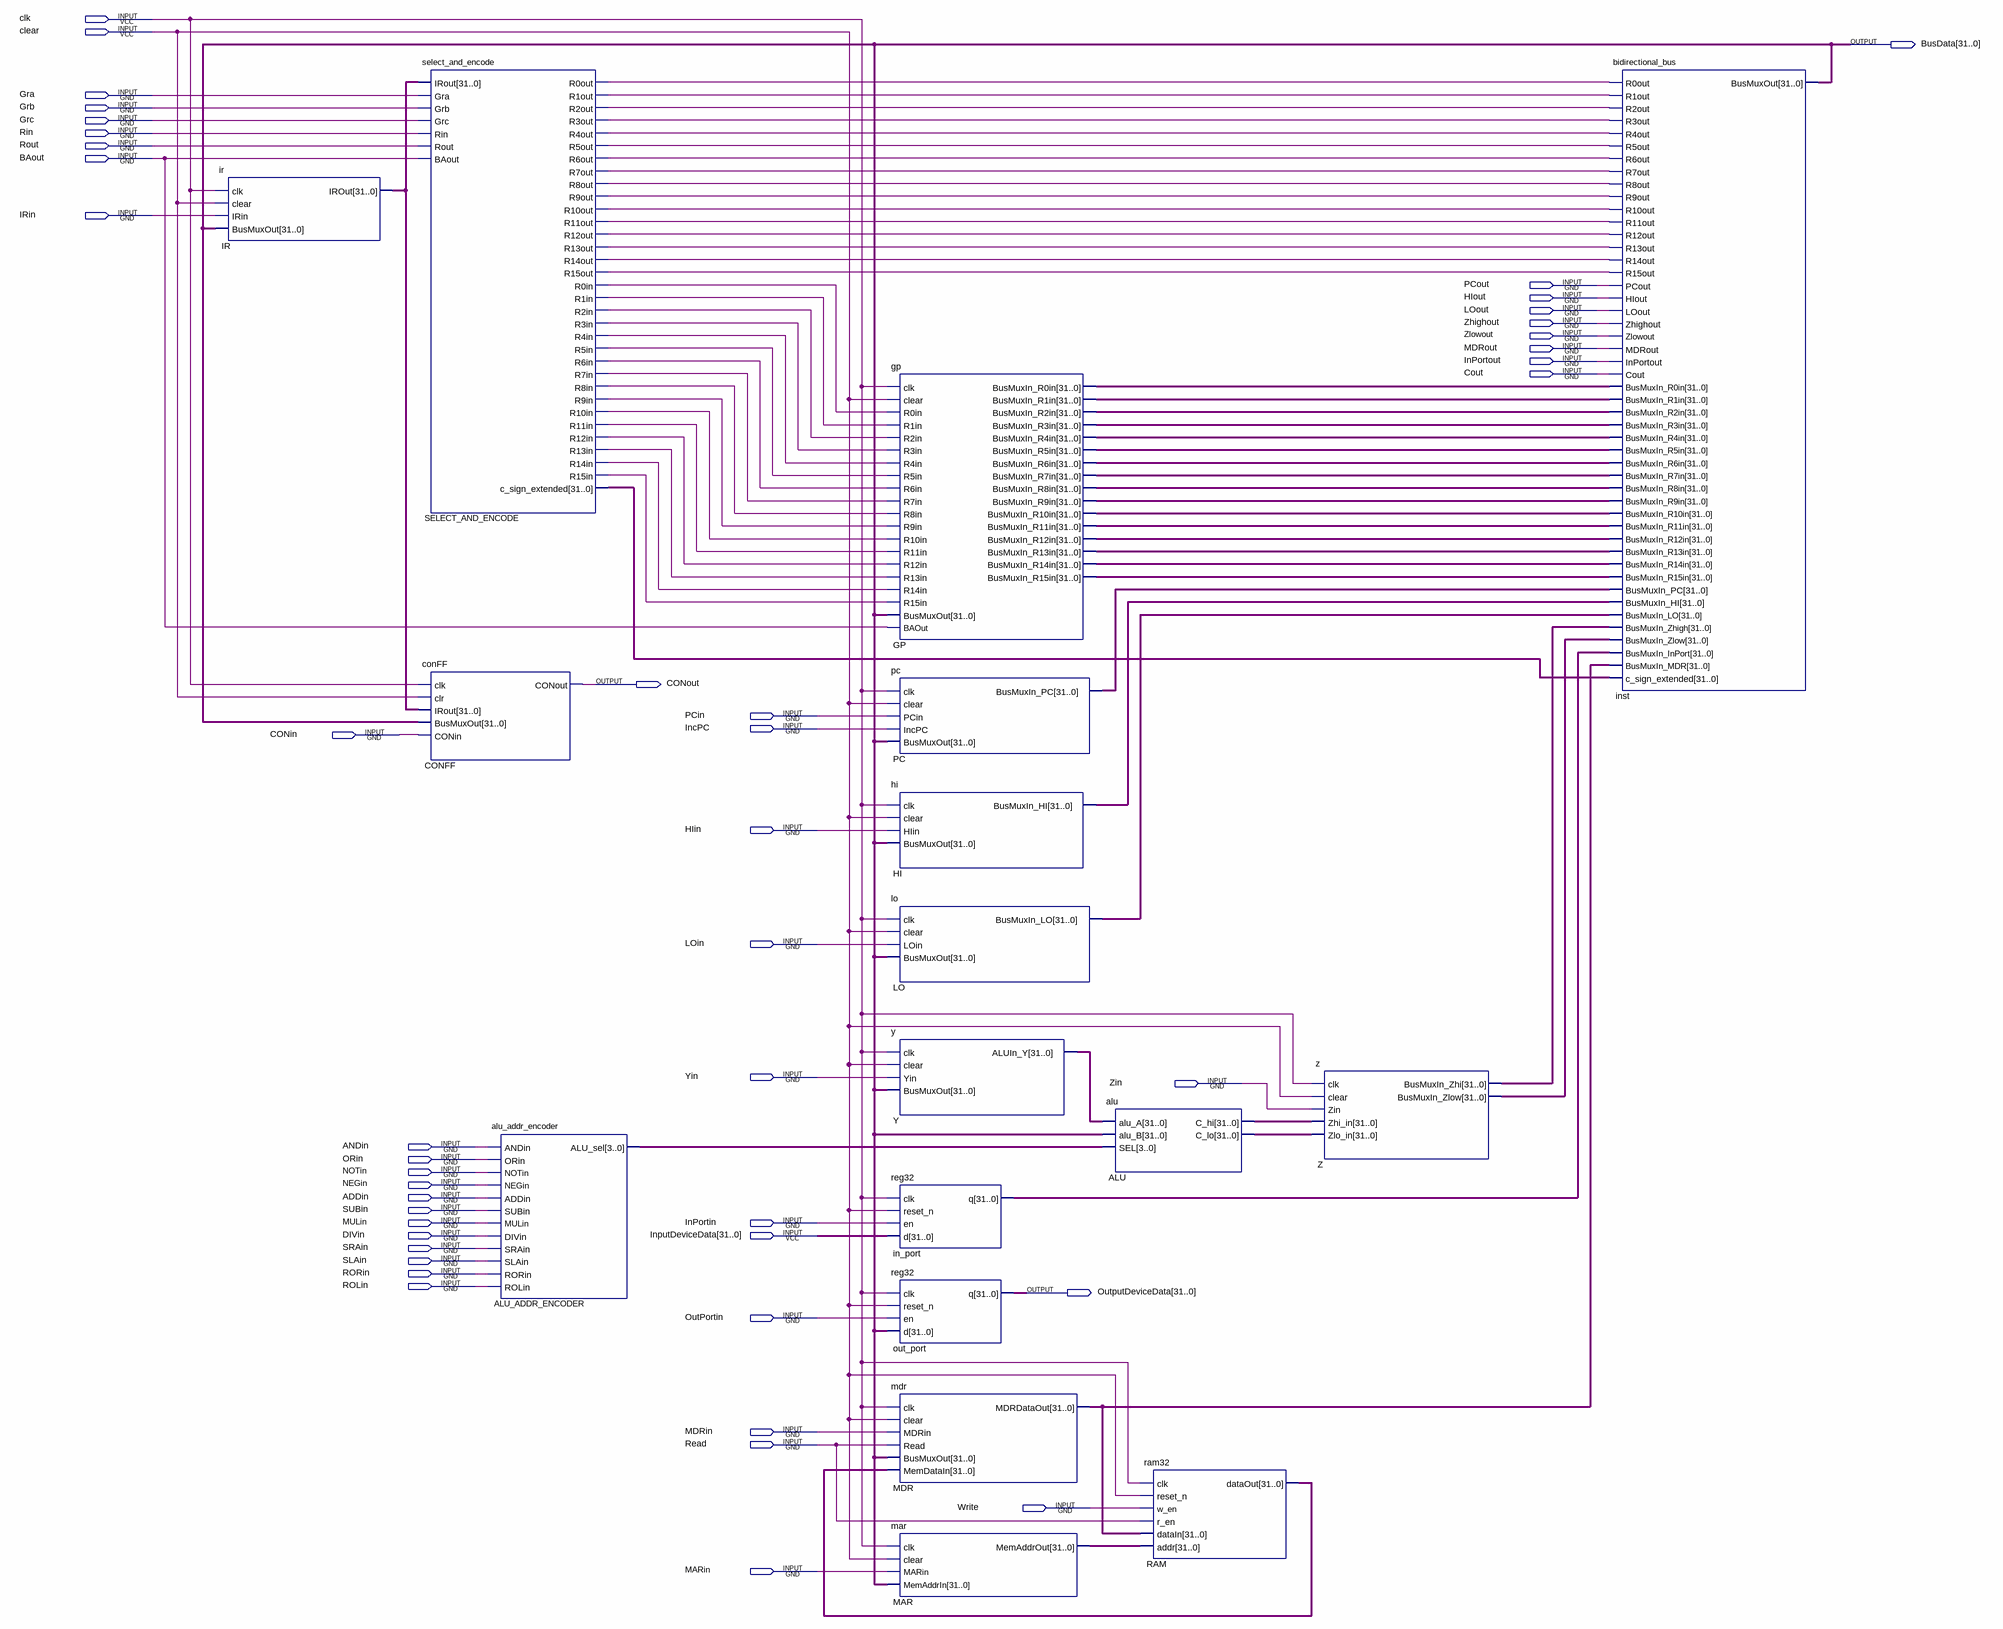
[diagram p0: schematic sheet]
// Quartus schematic datapath_design.bdf as structural Verilog: 17 symbols, 46 pins
module datapath_design (
  input  clk,
  input  clear,
  input  Gra,
  input  Grb,
  input  Grc,
  input  Rin,
  input  Rout,
  input  BAout,
  input  IRin,
  input  PCout,
  input  HIout,
  input  LOout,
  input  Zhighout,
  input  Zlowout,
  input  MDRout,
  input  InPortout,
  input  Cout,
  input  PCin,
  input  IncPC,
  input  CONin,
  input  HIin,
  input  LOin,
  input  Yin,
  input  Zin,
  input  ANDin,
  input  ORin,
  input  NOTin,
  input  NEGin,
  input  ADDin,
  input  SUBin,
  input  MULin,
  input  InPortin,
  input  DIVin,
  input  [31:0] InputDeviceData,
  input  SRAin,
  input  SLAin,
  input  RORin,
  input  ROLin,
  input  OutPortin,
  input  MDRin,
  input  Read,
  input  Write,
  input  MARin,
  output [31:0] BusData,
  output CONout,
  output [31:0] OutputDeviceData
);

  wire SELECT_AND_ENCODE_r0in, SELECT_AND_ENCODE_r0out, SELECT_AND_ENCODE_r1in, SELECT_AND_ENCODE_r1out,
       SELECT_AND_ENCODE_r2in, SELECT_AND_ENCODE_r2out, SELECT_AND_ENCODE_r3in, SELECT_AND_ENCODE_r3out,
       SELECT_AND_ENCODE_r4in, SELECT_AND_ENCODE_r4out, SELECT_AND_ENCODE_r5in, SELECT_AND_ENCODE_r5out,
       SELECT_AND_ENCODE_r6in, SELECT_AND_ENCODE_r6out, SELECT_AND_ENCODE_r7in, SELECT_AND_ENCODE_r7out,
       SELECT_AND_ENCODE_r8in, SELECT_AND_ENCODE_r8out, SELECT_AND_ENCODE_r9in, SELECT_AND_ENCODE_r9out,
       SELECT_AND_ENCODE_r10in, SELECT_AND_ENCODE_r10out, SELECT_AND_ENCODE_r11in, SELECT_AND_ENCODE_r11out,
       SELECT_AND_ENCODE_r12in, SELECT_AND_ENCODE_r12out, SELECT_AND_ENCODE_r13in, SELECT_AND_ENCODE_r13out,
       SELECT_AND_ENCODE_r14in, SELECT_AND_ENCODE_r14out, SELECT_AND_ENCODE_r15in, SELECT_AND_ENCODE_r15out;
  wire [3:0] ALU_ADDR_ENCODER_alu_sel;
  wire [31:0] ALU_c_hi, ALU_c_lo, GP_busmuxin_r0in, GP_busmuxin_r1in, GP_busmuxin_r2in, GP_busmuxin_r3in,
       GP_busmuxin_r4in, GP_busmuxin_r5in, GP_busmuxin_r6in, GP_busmuxin_r7in, GP_busmuxin_r8in,
       GP_busmuxin_r9in, GP_busmuxin_r10in, GP_busmuxin_r11in, GP_busmuxin_r12in, GP_busmuxin_r13in,
       GP_busmuxin_r14in, GP_busmuxin_r15in, HI_busmuxin_hi, in_port_q, IR_irout, LO_busmuxin_lo,
       MAR_memaddrout, MDR_mdrdataout, PC_busmuxin_pc, RAM_dataout, SELECT_AND_ENCODE_c_sign_extended,
       Y_aluin_y, Z_busmuxin_zhi, Z_busmuxin_zlow;

  ir IR (.clk(clk), .clear(clear), .IRin(IRin), .BusMuxOut(BusData), .IROut(IR_irout));
  select_and_encode SELECT_AND_ENCODE (
    .IRout(IR_irout), .Gra(Gra), .Grb(Grb), .Grc(Grc), .Rin(Rin), .Rout(Rout), .BAout(BAout),
    .R0out(SELECT_AND_ENCODE_r0out), .R1out(SELECT_AND_ENCODE_r1out), .R2out(SELECT_AND_ENCODE_r2out),
    .R3out(SELECT_AND_ENCODE_r3out), .R4out(SELECT_AND_ENCODE_r4out), .R5out(SELECT_AND_ENCODE_r5out),
    .R6out(SELECT_AND_ENCODE_r6out), .R7out(SELECT_AND_ENCODE_r7out), .R8out(SELECT_AND_ENCODE_r8out),
    .R9out(SELECT_AND_ENCODE_r9out), .R10out(SELECT_AND_ENCODE_r10out), .R11out(SELECT_AND_ENCODE_r11out),
    .R12out(SELECT_AND_ENCODE_r12out), .R13out(SELECT_AND_ENCODE_r13out), .R14out(SELECT_AND_ENCODE_r14out),
    .R15out(SELECT_AND_ENCODE_r15out), .R0in(SELECT_AND_ENCODE_r0in), .R1in(SELECT_AND_ENCODE_r1in),
    .R2in(SELECT_AND_ENCODE_r2in), .R3in(SELECT_AND_ENCODE_r3in), .R4in(SELECT_AND_ENCODE_r4in),
    .R5in(SELECT_AND_ENCODE_r5in), .R6in(SELECT_AND_ENCODE_r6in), .R7in(SELECT_AND_ENCODE_r7in),
    .R8in(SELECT_AND_ENCODE_r8in), .R9in(SELECT_AND_ENCODE_r9in), .R10in(SELECT_AND_ENCODE_r10in),
    .R11in(SELECT_AND_ENCODE_r11in), .R12in(SELECT_AND_ENCODE_r12in), .R13in(SELECT_AND_ENCODE_r13in),
    .R14in(SELECT_AND_ENCODE_r14in), .R15in(SELECT_AND_ENCODE_r15in),
    .c_sign_extended(SELECT_AND_ENCODE_c_sign_extended));
  conFF CONFF (.clk(clk), .clr(clear), .IRout(IR_irout), .BusMuxOut(BusData), .CONin(CONin), .CONout(CONout));
  alu_addr_encoder ALU_ADDR_ENCODER (
    .ANDin(ANDin), .ORin(ORin), .NOTin(NOTin), .NEGin(NEGin), .ADDin(ADDin), .SUBin(SUBin), .MULin(MULin),
    .DIVin(DIVin), .SRAin(SRAin), .SLAin(SLAin), .RORin(RORin), .ROLin(ROLin),
    .ALU_sel(ALU_ADDR_ENCODER_alu_sel));
  gp GP (
    .clk(clk), .clear(clear), .R0in(SELECT_AND_ENCODE_r0in), .R1in(SELECT_AND_ENCODE_r1in),
    .R2in(SELECT_AND_ENCODE_r2in), .R3in(SELECT_AND_ENCODE_r3in), .R4in(SELECT_AND_ENCODE_r4in),
    .R5in(SELECT_AND_ENCODE_r5in), .R6in(SELECT_AND_ENCODE_r6in), .R7in(SELECT_AND_ENCODE_r7in),
    .R8in(SELECT_AND_ENCODE_r8in), .R9in(SELECT_AND_ENCODE_r9in), .R10in(SELECT_AND_ENCODE_r10in),
    .R11in(SELECT_AND_ENCODE_r11in), .R12in(SELECT_AND_ENCODE_r12in), .R13in(SELECT_AND_ENCODE_r13in),
    .R14in(SELECT_AND_ENCODE_r14in), .R15in(SELECT_AND_ENCODE_r15in), .BusMuxOut(BusData), .BAOut(BAout),
    .BusMuxIn_R0in(GP_busmuxin_r0in), .BusMuxIn_R1in(GP_busmuxin_r1in), .BusMuxIn_R2in(GP_busmuxin_r2in),
    .BusMuxIn_R3in(GP_busmuxin_r3in), .BusMuxIn_R4in(GP_busmuxin_r4in), .BusMuxIn_R5in(GP_busmuxin_r5in),
    .BusMuxIn_R6in(GP_busmuxin_r6in), .BusMuxIn_R7in(GP_busmuxin_r7in), .BusMuxIn_R8in(GP_busmuxin_r8in),
    .BusMuxIn_R9in(GP_busmuxin_r9in), .BusMuxIn_R10in(GP_busmuxin_r10in), .BusMuxIn_R11in(GP_busmuxin_r11in),
    .BusMuxIn_R12in(GP_busmuxin_r12in), .BusMuxIn_R13in(GP_busmuxin_r13in),
    .BusMuxIn_R14in(GP_busmuxin_r14in), .BusMuxIn_R15in(GP_busmuxin_r15in));
  pc PC (.clk(clk), .clear(clear), .PCin(PCin), .IncPC(IncPC), .BusMuxOut(BusData), .BusMuxIn_PC(PC_busmuxin_pc));
  hi HI (.clk(clk), .clear(clear), .HIin(HIin), .BusMuxOut(BusData), .BusMuxIn_HI(HI_busmuxin_hi));
  lo LO (.clk(clk), .clear(clear), .LOin(LOin), .BusMuxOut(BusData), .BusMuxIn_LO(LO_busmuxin_lo));
  y Y (.clk(clk), .clear(clear), .Yin(Yin), .BusMuxOut(BusData), .ALUIn_Y(Y_aluin_y));
  reg32 in_port (.clk(clk), .reset_n(clear), .en(InPortin), .d(InputDeviceData), .q(in_port_q));
  reg32 out_port (.clk(clk), .reset_n(clear), .en(OutPortin), .d(BusData), .q(OutputDeviceData));
  mdr MDR (
    .clk(clk), .clear(clear), .MDRin(MDRin), .Read(Read), .BusMuxOut(BusData), .MemDataIn(RAM_dataout),
    .MDRDataOut(MDR_mdrdataout));
  mar MAR (.clk(clk), .clear(clear), .MARin(MARin), .MemAddrIn(BusData), .MemAddrOut(MAR_memaddrout));
  alu ALU (.alu_A(Y_aluin_y), .alu_B(BusData), .SEL(ALU_ADDR_ENCODER_alu_sel), .C_hi(ALU_c_hi), .C_lo(ALU_c_lo));
  ram32 RAM (
    .clk(clk), .reset_n(clear), .w_en(Write), .r_en(Read), .dataIn(MDR_mdrdataout), .addr(MAR_memaddrout),
    .dataOut(RAM_dataout));
  z Z (
    .clk(clk), .clear(clear), .Zin(Zin), .Zhi_in(ALU_c_hi), .Zlo_in(ALU_c_lo), .BusMuxIn_Zhi(Z_busmuxin_zhi),
    .BusMuxIn_Zlow(Z_busmuxin_zlow));
  bidirectional_bus inst (
    .R0out(SELECT_AND_ENCODE_r0out), .R1out(SELECT_AND_ENCODE_r1out), .R2out(SELECT_AND_ENCODE_r2out),
    .R3out(SELECT_AND_ENCODE_r3out), .R4out(SELECT_AND_ENCODE_r4out), .R5out(SELECT_AND_ENCODE_r5out),
    .R6out(SELECT_AND_ENCODE_r6out), .R7out(SELECT_AND_ENCODE_r7out), .R8out(SELECT_AND_ENCODE_r8out),
    .R9out(SELECT_AND_ENCODE_r9out), .R10out(SELECT_AND_ENCODE_r10out), .R11out(SELECT_AND_ENCODE_r11out),
    .R12out(SELECT_AND_ENCODE_r12out), .R13out(SELECT_AND_ENCODE_r13out), .R14out(SELECT_AND_ENCODE_r14out),
    .R15out(SELECT_AND_ENCODE_r15out), .PCout(PCout), .HIout(HIout), .LOout(LOout), .Zhighout(Zhighout),
    .Zlowout(Zlowout), .MDRout(MDRout), .InPortout(InPortout), .Cout(Cout), .BusMuxIn_R0in(GP_busmuxin_r0in),
    .BusMuxIn_R1in(GP_busmuxin_r1in), .BusMuxIn_R2in(GP_busmuxin_r2in), .BusMuxIn_R3in(GP_busmuxin_r3in),
    .BusMuxIn_R4in(GP_busmuxin_r4in), .BusMuxIn_R5in(GP_busmuxin_r5in), .BusMuxIn_R6in(GP_busmuxin_r6in),
    .BusMuxIn_R7in(GP_busmuxin_r7in), .BusMuxIn_R8in(GP_busmuxin_r8in), .BusMuxIn_R9in(GP_busmuxin_r9in),
    .BusMuxIn_R10in(GP_busmuxin_r10in), .BusMuxIn_R11in(GP_busmuxin_r11in),
    .BusMuxIn_R12in(GP_busmuxin_r12in), .BusMuxIn_R13in(GP_busmuxin_r13in),
    .BusMuxIn_R14in(GP_busmuxin_r14in), .BusMuxIn_R15in(GP_busmuxin_r15in), .BusMuxIn_PC(PC_busmuxin_pc),
    .BusMuxIn_HI(HI_busmuxin_hi), .BusMuxIn_LO(LO_busmuxin_lo), .BusMuxIn_Zhigh(Z_busmuxin_zhi),
    .BusMuxIn_Zlow(Z_busmuxin_zlow), .BusMuxIn_InPort(in_port_q), .BusMuxIn_MDR(MDR_mdrdataout),
    .c_sign_extended(SELECT_AND_ENCODE_c_sign_extended), .BusMuxOut(BusData));
endmodule
